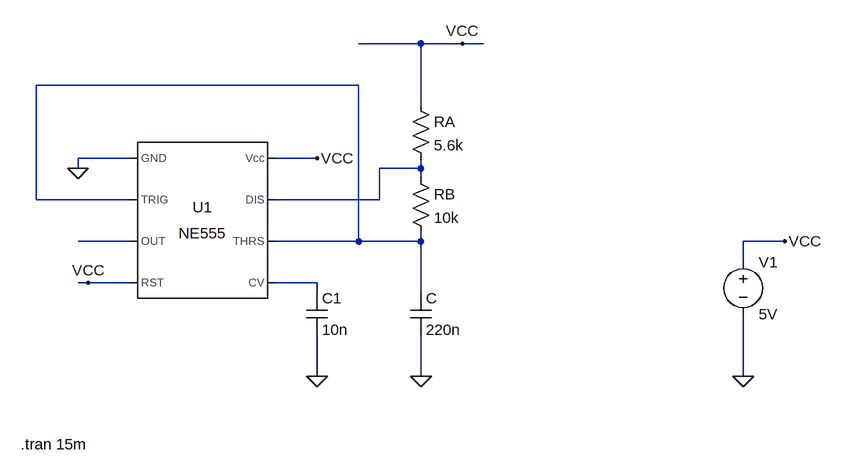
[diagram p0: schematic 555-Astable.asc]
555-Astable.asc, the LTspice schematic file:
Version 4
SHEET 1 1212 680
WIRE 576 -80 480 -80
WIRE 640 -80 576 -80
WIRE 672 -80 640 -80
WIRE 480 -16 -16 -16
WIRE 576 16 576 -80
WIRE 128 96 48 96
WIRE 416 96 352 96
WIRE 48 112 48 96
WIRE 576 112 576 96
WIRE 576 112 512 112
WIRE 576 128 576 112
WIRE -16 160 -16 -16
WIRE 128 160 -16 160
WIRE 512 160 512 112
WIRE 512 160 352 160
WIRE 128 224 48 224
WIRE 480 224 480 -16
WIRE 480 224 352 224
WIRE 576 224 576 208
WIRE 576 224 480 224
WIRE 1136 224 1072 224
WIRE 1072 256 1072 224
WIRE 64 288 48 288
WIRE 128 288 64 288
WIRE 416 288 352 288
WIRE 416 304 416 288
WIRE 576 304 576 224
WIRE 416 432 416 368
WIRE 576 432 576 368
WIRE 1072 432 1072 336
FLAG 1072 432 0
FLAG 1136 224 VCC
FLAG 416 96 VCC
FLAG 48 112 0
FLAG 640 -80 VCC
FLAG 576 432 0
FLAG 64 288 VCC
FLAG 416 432 0
SYMBOL res 560 0 R0
SYMATTR InstName RA
SYMATTR Value 5.6k
SYMBOL res 560 112 R0
SYMATTR InstName RB
SYMATTR Value 10k
SYMBOL cap 560 304 R0
SYMATTR InstName C
SYMATTR Value 220n
SYMBOL voltage 1072 240 R0
WINDOW 123 0 0 Left 0
WINDOW 39 0 0 Left 0
SYMATTR InstName V1
SYMATTR Value 5V
SYMBOL Misc\\NE555 240 192 R0
SYMATTR InstName U1
SYMBOL cap 400 304 R0
SYMATTR InstName C1
SYMATTR Value 10n
TEXT -40 536 Left 0 !.tran 15m

The netlist it stands for:
* 555-Astable.asc
RA VCC N002 5.6k
RB N002 N001 10k
C N001 0 220n
V1 VCC 0 5V
XU1 0 N001 N003 VCC N004 N001 N002 VCC NE555  ; pins GND TRIG OUT RST CV THRS DIS Vcc
C1 N004 0 10n
.tran 15m
.lib NE555.sub
.backanno
.end